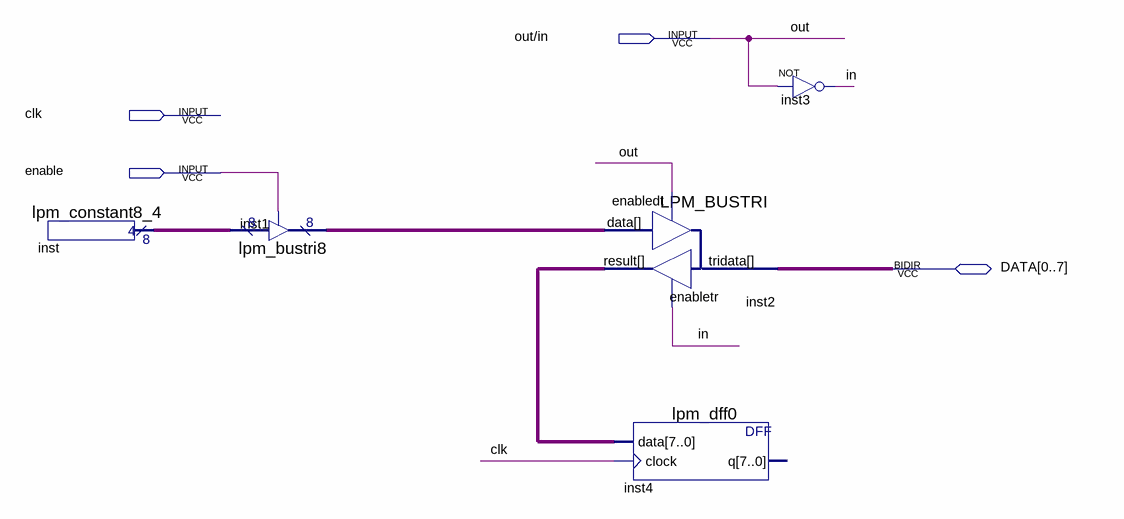
[diagram p0: schematic sheet]
// Quartus schematic PD2.bdf as structural Verilog: 5 symbols, 4 pins
module PD2 (
  input  \out/in ,
  input  clk,
  input  enable,
  inout  [0:7] DATA
);

  wire in;
  wire [7:0] inst1_tridata, inst2_result, inst_result;

  lpm_constant8_4 inst (.result(inst_result));
  lpm_bustri8 inst1 (.enabledt(enable), .data(inst_result), .tridata(inst1_tridata));
  LPM_BUSTRI inst2 (.data(inst1_tridata), .enabledt(\out/in ), .enabletr(in), .result(inst2_result), .tridata(DATA));
  lpm_dff0 inst4 (.data(inst2_result), .clock(clk));  // open: q
  not inst3 (in, \out/in );

  // Other names for the same wires on the sheet: out = \out/in 
endmodule
